# EasyEDA Pro project P1.eprj, board PCB_main_2025-03-03
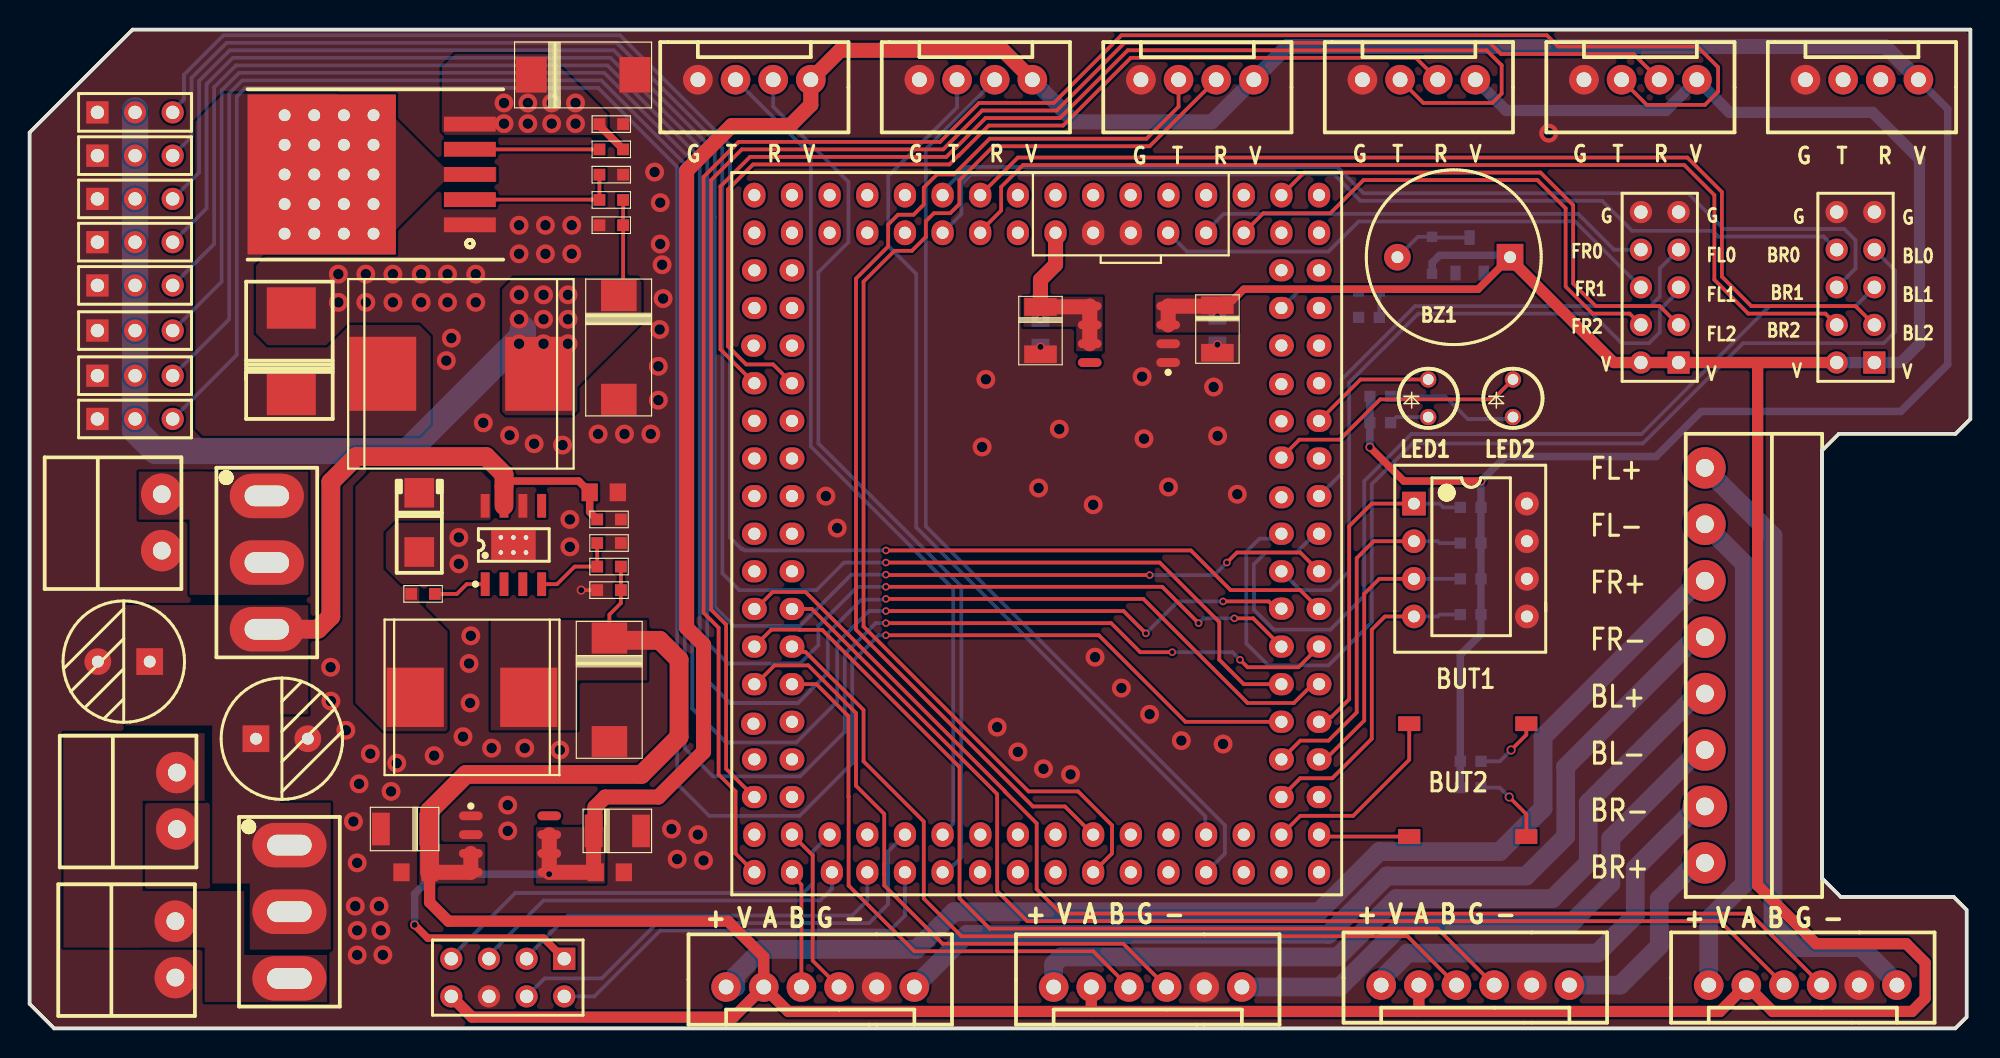
[diagram p4: board, top side]
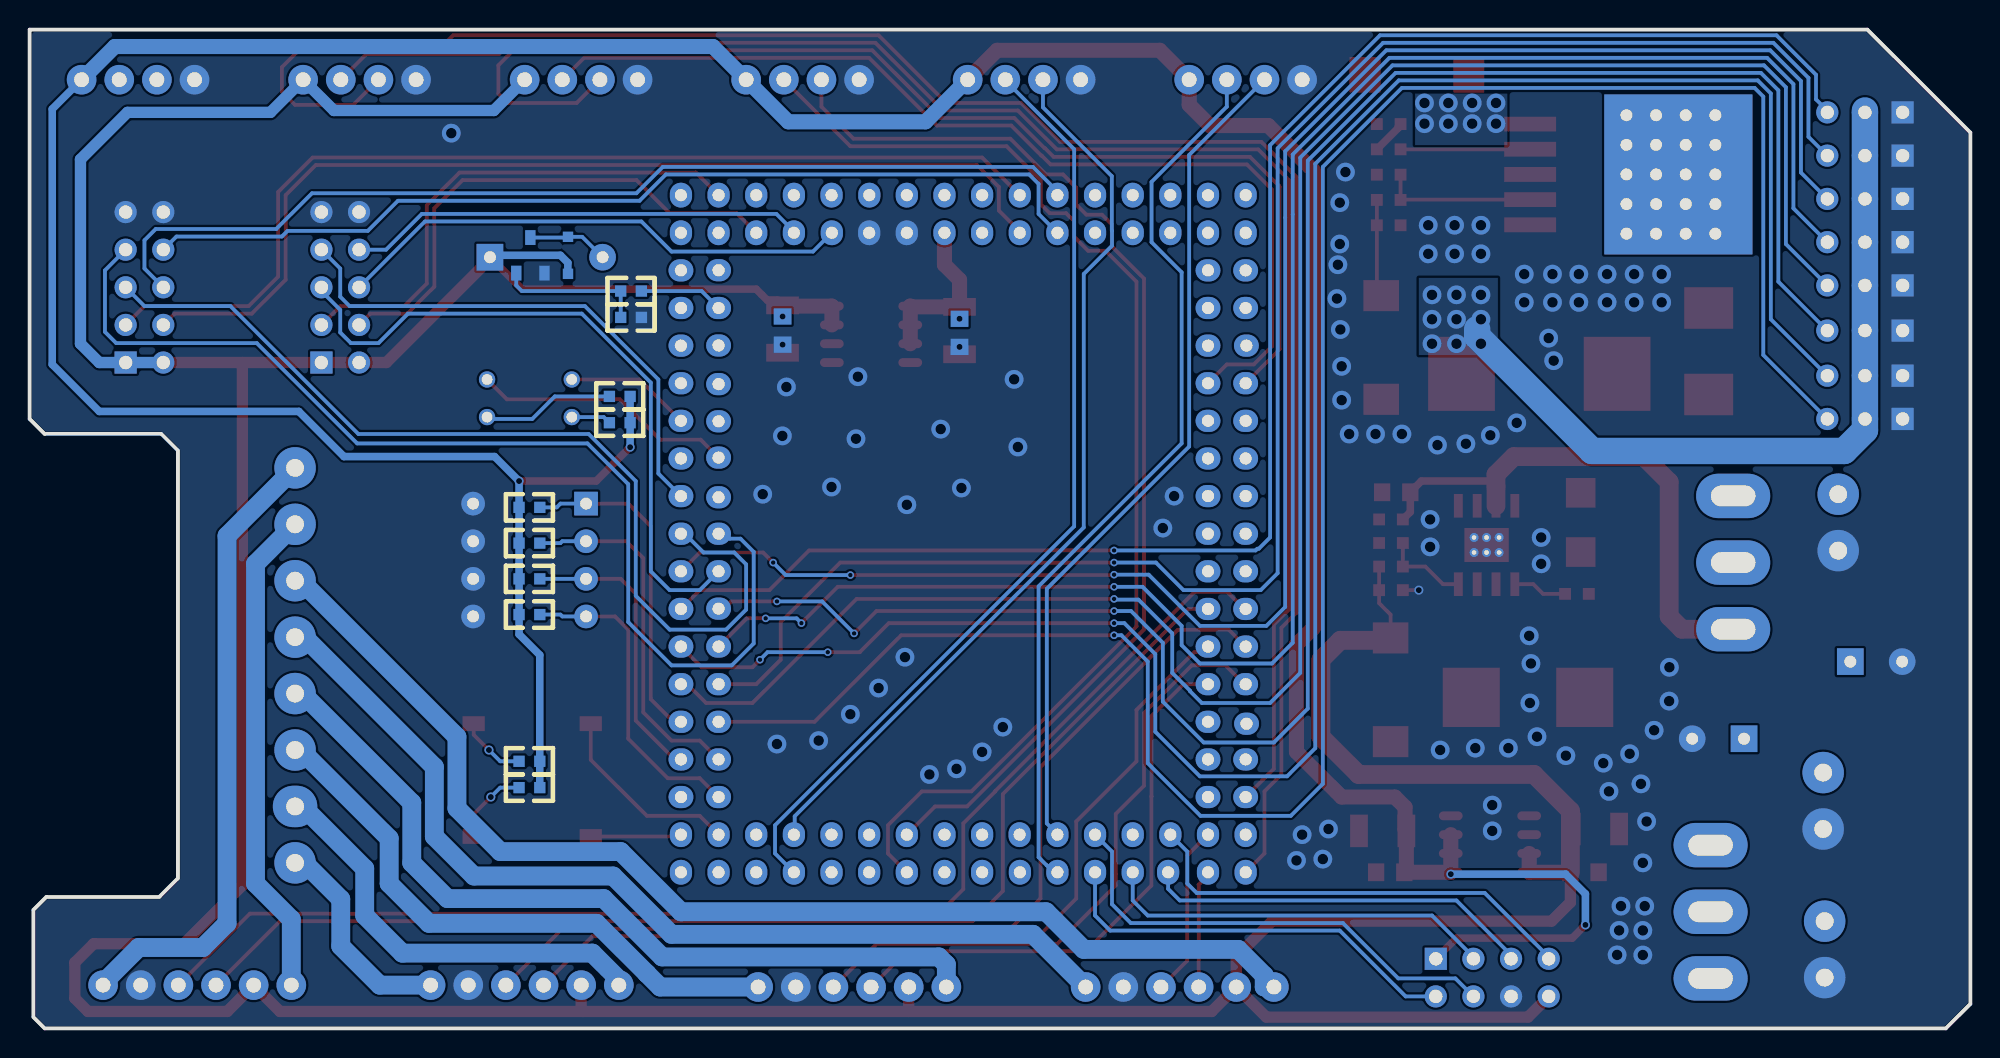
[diagram p5: board, bottom side, seen from below]

Outline 130.94 x 67.44 mm; copper layers: Top Layer, Bottom Layer. Coordinates in mm from the lower left corner of the outline.
Outline path: 0,60.49 6.95,67.44 130.94,67.44 130.94,41.15 129.94,40.15 122.06,40.15 120.94,39.02 120.94,10.13 122.19,8.88 129.81,8.88 130.68,8 130.68,0.76 129.92,0 1.65,0 0,1.65 0,60.49
Stack: Top Layer 0.035mm / Dielectric1 1.51mm FR4 er 4.5 / Bottom Layer 0.035mm

## Design rules (mm)
spacing safeClearance (default): track to track 0.152, other pairs 0.152 to 0.3
track width trackWidth (default): min 0.127, default 0.254, max 2.54
differential pair differentialPair (default): width min 0.127, default 0.254, max 2.54; gap min 0.152, default 0.152
via viaSize (default): diameter min 0.5, default 0.61, max 10; hole min 0.3, default 0.305, max 6
pour ie405 uses CopperRegion
pour ie1011 uses (1)

## Placement (name value [footprint] x y rotation side)
BZ1  Device Name  [BUZZER ACTIVE 12X9]  96.08 52.07 180 top
C14  Device Name  [CAP ELEC 3.5-8.0X12.0(__0.6)]  6.35 24.77 180 top
C15  Device Name  [CAP ELEC 3.5-8.0X12.0(__0.6)]  17.02 19.56 0 top
C38  NO  [CAP TANT 2917/7343-31]  37.34 64.39 180 top
C40  xxuF/xxV/Footprint  [CAP MLCC 0603]  39.24 61.06 0 top
C41  xxuF/xxV/Footprint  [CAP MLCC 0603]  39.24 59.35 0 top
C42  NO  [CAP TANT 2917/7343-31]  39.75 45.97 90 top
C43  xxuF/xxV/Footprint  [CAP MLCC 0603]  39.24 54.23 180 top
C44  xxuF/xxV/Footprint  [CAP MLCC 0805]  38.73 36.2 180 top
C45  xxuF/xxV/Footprint  [CAP MLCC 0603]  39.09 34.36 180 top
C46  xxuF/xxV/Footprint  [CAP MLCC 0603]  26.54 29.34 180 top
C47  NO  [CAP TANT 2917/7343-31]  39.12 22.86 90 top
C48  xxuF/xxV/Footprint  [CAP MLCC 0603]  39.09 29.59 0 top
C56  Device Name  [CAP TANT 1210/3528-21]  80.14 47.22 90 top
C57  Device Name  [CAP MLCC 0805]  80.14 47.12 270 bottom
C58  Device Name  [CAP TANT 1210/3528-21]  68.2 47.12 90 top
C59  Device Name  [CAP MLCC 0805]  68.2 46.96 270 bottom
C76  Device Name  [CAP TANT 1210/3528-21]  25.3 13.46 0 top
C77  Device Name  [CAP MLCC 0805]  26.03 10.54 180 top
C78  Device Name  [CAP TANT 1210/3528-21]  39.65 13.34 180 top
C79  Device Name  [CAP MLCC 0805]  39.14 10.54 0 top
D4  MBRS540/40V/5A  [DO-214AB]  17.65 46.48 270 top
D5  Device Name  [DIODE SMA(DO-214AC)]  26.29 34.16 270 top
D6  Device Name  [DIODE SOD323]  94.61 52.2 90 bottom
J2  HDR-M-2.54_2x5  [HDR2X5]  111.25 44.96 90 top
J3  HDR-M-2.54_2x5  [HDR2X5]  124.46 44.96 90 top
L1  Device Name  [INDC SMDP 744355(13X13)]  29.08 44.2 0 top
L2  Device Name  [INDC SMDP 744325(11X10.5)]  29.84 22.35 0 top
LED1  直插LED  [3MMLED__Ɫ]  100.08 42.55 90 top
LED2  直插LED  [3MMLED__Ɫ]  94.36 42.55 90 top
LQ_KV58P144-SYSVG1  LQ_KV58P144-SYSVG  [KV58_CORE_LQ]  87 15.62 90 top
M1  XH2.54-6  [XH2.54_6]  119.63 2.79 180 top
M2  XH2.54-6  [XH2.54_6]  75.44 2.67 180 top
M3  XH2.54-6  [XH2.54_6]  53.34 2.67 180 top
M4  XH2.54-6  [XH2.54_6]  97.54 2.79 180 top
P1  WJ15EDGRC-3.81-8P  [WJ2EDG-3.81-8P]  113.03 24.51 90 top
P5  WJ15EDGRC-3.81-2P  [WJ2EDG-3.81-2P]  9.02 34.16 270 top
P8  WJ15EDGRC-3.81-2P  [WJ2EDG-3.81-2P]  9.93 5.33 270 top
P9  -  [WJ2EDG-3.81-2P]  10.03 15.37 270 top
P9#2  -  [HDR2X4]  36.07 4.7 180 top
Q3  Device Name  [SOT23-3W]  97.16 52.2 270 bottom
R15  xxR/Precision/Footprint  [RES 0603]  39.24 55.94 0 top
R16  xxR/Precision/Footprint  [RES 0603]  39.24 57.64 180 top
R17  xxR/Precision/Footprint  [RES 0603]  39.09 31.18 0 top
R18  xxR/Precision/Footprint  [RES 0603]  39.09 32.77 180 top
R22  xxR/Precision/Footprint  [0603]  89.66 49.78 0 bottom
R23  xxR/Precision/Footprint  [0603]  89.66 48.01 0 bottom
R31  xxR/Precision/Footprint  [0603]  91.82 42.67 180 bottom
R32  xxR/Precision/Footprint  [0603]  91.82 40.89 180 bottom
R33  xxR/Precision/Footprint  [0603]  97.92 18.03 180 bottom
R34  xxR/Precision/Footprint  [0603]  97.92 16.26 180 bottom
R100  xxR/Precision/Footprint  [0603]  97.92 35.18 180 bottom
R101  xxR/Precision/Footprint  [0603]  97.92 32.77 180 bottom
R102  xxR/Precision/Footprint  [0603]  97.92 30.35 180 bottom
R103  xxR/Precision/Footprint  [0603]  97.92 27.94 180 bottom
S2  Device Name  [SWITCH DIP 2.54-4]  97.28 31.62 0 top
S3  Device Name  [BUTTON SMD 3X6]  97.03 12.95 180 top
S4  Device Name  [SWITCH TOGGLE 7101SYZBE CK]  16 31.45 270 top
S8  Device Name  [SWITCH TOGGLE 7101SYZBE CK]  17.53 7.87 270 top
S9  Device Name  [BUTTON SMD 3X6]  97.03 20.57 180 top
SERVO1  HDR-M-2.54_1x3  [HDR1X3]  4.57 41.15 0 top
SERVO2  HDR-M-2.54_1x3  [HDR1X3]  4.57 50.17 0 top
SERVO3  HDR-M-2.54_1x3  [HDR1X3]  4.57 58.93 0 top
SERVO4  HDR-M-2.54_1x3  [HDR1X3]  4.57 44.07 0 top
SERVO5  HDR-M-2.54_1x3  [HDR1X3]  4.57 53.09 0 top
SERVO6  HDR-M-2.54_1x3  [HDR1X3]  4.57 61.85 0 top
SERVO7  HDR-M-2.54_1x3  [HDR1X3]  4.57 47.12 0 top
SERVO8  HDR-M-2.54_1x3  [HDR1X3]  4.57 56.01 0 top
U16  XL4015  [TO-263-5]  23.45 57.66 90 top
U17  TPS5430  [SOIC8_1.27-PAD]  32.64 32.64 90 top
U18  TPS7333QD  [SOIC8_1.27]  32.41 12.45 270 top
U24  TPS7333QD  [SOIC8_1.27]  74.17 46.86 90 top
UART0  XH2.54-4  [XH2.54_4]  93.73 64.06 0 top
UART1  XH2.54-4  [XH2.54_4]  108.68 64.06 0 top
UART2  XH2.54-4  [XH2.54_4]  78.79 64.06 0 top
UART3  XH2.54-4  [XH2.54_4]  123.62 64.06 0 top
UART4  XH2.54-4  [XH2.54_4]  48.89 64.06 0 top
UART5  XH2.54-4  [XH2.54_4]  63.84 64.06 0 top

## Footprints (pads in the part's own frame, mm; a bottom-side part is the same pattern mirrored in y, then rotated)
3MMLED__Ɫ
  round 1.1 hole 0.72: 1(-1.27,0) 2(1.27,0)
0603
  rect 0.762x0.762 smd: 1(0,0) 2(1.397,0)
BUTTON SMD 3X6
  rect 1.5x1 smd: 1(-3.95,0) 2(3.95,0)
BUZZER ACTIVE 12X9
  rect 1.8x1.8 hole 0.8: 1(-3.8,0)
  round 1.8 hole 0.8: 2(3.8,0)
CAP ELEC 3.5-8.0X12.0(__0.6)
  rect 1.8x1.8 hole 0.8: 1(-1.75,0)
  round 1.8 hole 0.8: 2(1.75,0)
CAP MLCC 0603
  rect 0.8x0.8 smd: 1(-0.8,0) 2(0.8,0)
CAP MLCC 0805
  rect 1.1x1.2 smd: 1(-0.95,0) 2(0.95,0)
CAP TANT 1210/3528-21
  rect 1.2x2.2 smd: 1(1.6,0) 2(-1.6,0)
CAP TANT 2917/7343-31
  rect 2.1x2.4 smd: 1(3.5,0) 2(-3.5,0)
DIODE SMA(DO-214AC)
  rect 2x2 smd: 1(2,0) 2(-2,0)
DIODE SOD323
  rect 0.7x0.7 smd: 1(1.25,0) 2(-1.25,0)
DO-214AB
  rect 2.8x3.3 smd: 1(-2.159,0) 2(3.683,0)
HDR1X3
  rect 1.5x1.5 hole 0.9: 1(0,0)
  round 1.5 hole 0.9: 2(2.54,0) 3(5.08,0)
HDR2X4
  rect 1.5x1.5 hole 0.9: 1(0,0)
  round 1.5 hole 0.9: 2(0,2.54) 3(2.54,0) 4(2.54,2.54) 5(5.08,0) 6(5.08,2.54) 7(7.62,0) 8(7.62,2.54)
HDR2X5
  rect 1.5x1.5 hole 0.9: 1(0,0)
  round 1.5 hole 0.9: 2(0,2.54) 3(2.54,0) 4(2.54,2.54) 5(5.08,0) 6(5.08,2.54) 7(7.62,0) 8(7.62,2.54) 9(10.16,0) 10(10.16,2.54)
INDC SMDP 744325(11X10.5)
  rect 3.85x4 smd: 1(-3.83,0) 2(3.83,0)
INDC SMDP 744355(13X13)
  rect 4.5x5 smd: 1(-5.25,0) 2(5.25,0)
KV58_CORE_LQ
  oval 1.498x1.677 hole 0.813x0.818: 1(0,0) 2(0,2.54) 3(2.54,0) 4(2.54,2.54) 5(5.08,0) 6(5.08,2.54) 7(7.62,0) 8(7.62,2.54) 9(10.16,0) 10(10.16,2.54) 11(12.7,0) 12(12.72,2.54) 13(15.24,0) 14(15.24,2.54) 15(17.78,0) 16(17.78,2.54) 17(20.32,0) 18(20.24,2.54) 19(22.86,0) 20(22.92,2.54) 21(25.4,0) 22(25.37,2.54) 23(27.94,0) 24(27.88,2.54) 25(30.48,0) 26(30.49,2.54) 27(33.02,0) 28(33.02,2.54) 29(35.56,0) 30(35.57,2.54) 63(35.56,38.1) 64(35.56,35.56) 65(33.02,38.1) 66(33.02,35.56) 67(30.48,38.15) 68(30.48,35.56) 69(27.94,38.1) 70(27.94,35.56) 71(25.4,38.1) 72(25.4,35.56) 73(22.86,38.1) 74(22.86,35.56) 75(20.32,38.1) 76(20.32,35.56) 77(17.78,38.1) 78(17.78,35.56) 79(15.24,38.1) 80(15.24,35.56) 81(12.7,38.1) 82(12.7,35.56) 83(10.16,38.1) 84(10.16,35.56) 85(7.62,38.1) 86(7.62,35.56) 87(4.95,38.16) 88(5.08,35.56) 89(2.54,38.1) 90(2.54,35.56) 91(0,38.1) 92(0,35.56)
  oval 1.677x1.498 hole 0.818x0.813: 31(38.1,0) 32(40.64,0) 33(38.1,2.54) 34(40.64,2.54) 35(38.1,5.08) 36(40.64,5.08) 37(38.1,7.62) 38(40.64,7.62) 39(38.1,10.18) 40(40.64,10.16) 41(38.1,12.7) 42(40.64,12.71) 43(38.1,15.24) 44(40.64,15.24) 45(38.1,17.78) 46(40.64,17.78) 47(38.1,20.32) 48(40.64,20.32) 49(38.1,22.86) 50(40.64,22.86) 51(38.1,25.4) 52(40.64,25.4) 53(38.1,27.94) 54(40.64,27.94) 55(38.1,30.48) 56(40.64,30.48) 57(38.1,33.02) 58(40.64,33.02) 59(38.1,35.56) 60(40.64,35.56) 61(38.1,38.1) 62(40.64,38.1) 93(-2.54,38.1) 94(-5.08,38.1) 95(-2.54,35.56) 96(-5.08,35.56) 97(-2.54,33.02) 98(-5.08,32.87) 99(-2.54,30.48) 100(-5.08,30.48) 101(-2.54,27.94) 102(-5.08,27.94) 103(-2.54,25.4) 104(-5.08,25.4) 105(-2.54,22.85) 106(-5.08,22.87) 107(-2.54,20.32) 108(-5.08,20.32) 109(-2.54,17.78) 110(-5.08,17.78) 111(-2.54,15.24) 112(-5.08,15.24) 113(-2.54,12.7) 114(-5.08,12.7) 115(-2.54,10.16) 116(-5.08,10.16) 117(-2.54,7.62) 118(-5.08,7.62) 119(-2.54,5.08) 120(-5.08,5.08) 121(-2.54,2.54) 122(-5.08,2.54) 123(-2.54,0) 124(-5.08,0)
RES 0603
  rect 0.8x0.8 smd: 1(-0.8,0) 2(0.8,0)
SOIC8_1.27
  oval 0.6x1.6 smd: 1(-1.905,-2.645) 2(-0.635,-2.645) 3(0.635,-2.645) 4(1.905,-2.645) 5(1.905,2.645) 6(0.635,2.645) 7(-0.635,2.645) 8(-1.905,2.645)
SOIC8_1.27-PAD
  rect 1.6x0.6 smd: 1(-2.645,1.905) 2(-2.645,0.635) 3(-2.645,-0.635) 4(-2.645,-1.905) 5(2.645,-1.905) 6(2.645,-0.635) 7(2.645,0.635) 8(2.645,1.905)
  round 0.61 hole 0.31x0.305: 9(-0.508,0.847) 9(-0.508,0) 9(-0.508,-0.847) 9(0.508,0.847) 9(0.508,0) 9(0.508,-0.847)
  rect 2.3x3 smd: 9(0,0)
SOT23-3W
  rect 1x0.7 smd: 1(1.2,-0.95) 2(1.2,0.95) 3(-1.2,0)
SWITCH DIP 2.54-4
  rect 1.6x1.6 hole 0.8: 1(-3.886,3.81)
  round 1.6 hole 0.8: 2(-3.886,1.27) 3(-3.886,-1.27) 4(-3.886,-3.81) 5(3.734,-3.81) 6(3.734,-1.27) 7(3.734,1.27) 8(3.734,3.81)
SWITCH TOGGLE 7101SYZBE CK
  oval 3x5 hole 1.4x3: 1(-4.5,0) 2(0,0) 3(4.5,0)
TO-263-5
  rect 1x3.5 smd: 1(-3.4,-6.25) 2(-1.7,-6.25) 3(0,-6.25) 4(1.7,-6.25) 5(3.4,-6.25)
  round 1.5 hole 0.8: 6(-4,6.25) 6(-4,4.25) 6(-4,2.25) 6(-4,0.25) 6(-2,6.25) 6(-2,4.25) 6(-2,2.25) 6(-2,0.25) 6(0,6.25) 6(0,4.25) 6(0,2.25) 6(0,0.25) 6(2,6.25) 6(2,4.25) 6(2,2.25) 6(2,0.25) 6(4,6.25) 6(4,4.25) 6(4,2.25) 6(4,0.25)
  rect 10.8x10 smd: 6(0,3.75)
  rect 10.8x10 smd far side: 6(0,3.75)
WJ2EDG-3.81-2P
  round 2.8 hole 1.2: 1(1.905,-0.102) 2(-1.905,-0.102)
WJ2EDG-3.81-8P
  round 2.8 hole 1.2: 1(13.335,0) 2(9.525,0) 3(5.715,0) 4(1.905,0) 5(-1.905,0) 6(-5.715,0) 8(-13.335,0)
  oval 2.8x3 hole 1.2: 7(-9.525,0)
XH2.54_4
  round 2 hole 1: 1(-3.81,0) 2(-1.27,0) 3(1.27,0) 4(3.81,0)
XH2.54_6
  round 2 hole 1: 1(-6.35,-0.127) 2(-3.81,-0.127) 3(-1.27,-0.127) 4(1.27,-0.127) 5(3.81,-0.127) 6(6.35,-0.127)

## Nets
3V3: C58.1 C59.1 LQ_KV58P144-SYSVG1.45 U24.5 U24.6 U24.7
3V3_OTH: C78.1 C79.1 P9#2.1 R31.2 R32.2 R33.2 R34.2 R100.1 R101.1 R102.1 R103.1 U18.5 U18.6 U18.7 UART2.4 UART3.4 UART4.4 UART5.4
5V: BZ1.1 C47.1 C48.2 C56.1 C57.1 C76.1 C77.1 D6.2 J2.1 J2.2 J3.1 J3.2 L2.2 M1.5 M2.5 M3.5 M4.5 P9#2.8 R17.2 U18.3 U18.4 U24.3 U24.4 UART0.4 UART1.4
GND: C14.2 C15.2 C38.2 C40.2 C42.2 C43.2 C44.1 C45.1 C47.2 C48.1 C56.2 C57.2 C58.2 C59.2 C76.2 C77.2 C78.2 C79.2 D4.1 D5.1 J2.9 J2.10 J3.9 J3.10 LQ_KV58P144-SYSVG1.41 LQ_KV58P144-SYSVG1.43 M1.2 M2.2 M3.2 M4.2 P5.1 P8.1 P9.1 P9#2.6 Q3.2 R16.1 R18.1 R23.1 S2.5 S2.6 S2.7 S2.8 SERVO1.1 SERVO2.1 SERVO3.1 SERVO4.1 SERVO5.1 SERVO6.1 SERVO7.1 SERVO8.1 U16.1 U17.6 U17.9 U18.1 U18.2 U24.1 U24.2 UART0.1 UART1.1 UART2.1 UART3.1 UART4.1 UART5.1
VCC: P8.2 P9.2 S8.3
VIN: C14.1 C15.1 C38.1 C40.1 C41.2 C44.2 C45.2 S4.3 S8.1 S8.2 U16.5 U17.7
ADC0_SE0: LQ_KV58P144-SYSVG1.26
ADC0_SE8: LQ_KV58P144-SYSVG1.27
BEEP_PWM: LQ_KV58P144-SYSVG1.28 R22.1
BUT1: LQ_KV58P144-SYSVG1.121 S9.2
BUT2: LQ_KV58P144-SYSVG1.123 S3.2
DAC0: LQ_KV58P144-SYSVG1.29
DAC1: LQ_KV58P144-SYSVG1.30
GPIO1: LQ_KV58P144-SYSVG1.100 P9#2.3
GPIO2: LQ_KV58P144-SYSVG1.98 P9#2.5
GPIO3: LQ_KV58P144-SYSVG1.97 P9#2.7
GPIO4: LQ_KV58P144-SYSVG1.102 P9#2.2
GPIO5: LQ_KV58P144-SYSVG1.101 P9#2.4
HSADC0CH2: LQ_KV58P144-SYSVG1.22
HSADC0CH3: LQ_KV58P144-SYSVG1.23
HSADC0CH6: LQ_KV58P144-SYSVG1.18
HSADC0CH7: LQ_KV58P144-SYSVG1.19
HSADC0CH10: LQ_KV58P144-SYSVG1.24
HSADC0CH11: LQ_KV58P144-SYSVG1.25
HSADC0CH12: LQ_KV58P144-SYSVG1.31
LED1: LED1.2 LQ_KV58P144-SYSVG1.20
LED2: LED2.2 LQ_KV58P144-SYSVG1.21
MOTOR_BL_+: M2.6 P1.5
MOTOR_BL_-: M2.1 P1.6
MOTOR_BL_A: LQ_KV58P144-SYSVG1.86 M2.4
MOTOR_BL_B: LQ_KV58P144-SYSVG1.85 M2.3
MOTOR_BR_+: M4.1 P1.8
MOTOR_BR_-: M4.6 P1.7
MOTOR_BR_A: LQ_KV58P144-SYSVG1.84 M4.4
MOTOR_BR_B: LQ_KV58P144-SYSVG1.83 M4.3
MOTOR_DIR_BL1: J3.5 LQ_KV58P144-SYSVG1.15
MOTOR_DIR_BL2: J3.7 LQ_KV58P144-SYSVG1.16
MOTOR_DIR_BR1: J3.6 LQ_KV58P144-SYSVG1.52
MOTOR_DIR_BR2: J3.8 LQ_KV58P144-SYSVG1.51
MOTOR_DIR_FL1: J2.5 LQ_KV58P144-SYSVG1.14
MOTOR_DIR_FL2: J2.7 LQ_KV58P144-SYSVG1.17
MOTOR_DIR_FR1: J2.6 LQ_KV58P144-SYSVG1.39
MOTOR_DIR_FR2: J2.8 LQ_KV58P144-SYSVG1.37
MOTOR_FL_+: M1.1 P1.1
MOTOR_FL_-: M1.6 P1.2
MOTOR_FL_A: LQ_KV58P144-SYSVG1.82 M1.4
MOTOR_FL_B: LQ_KV58P144-SYSVG1.81 M1.3
MOTOR_FR_+: M3.6 P1.3
MOTOR_FR_-: M3.1 P1.4
MOTOR_FR_A: LQ_KV58P144-SYSVG1.96 M3.4
MOTOR_FR_B: LQ_KV58P144-SYSVG1.95 M3.3
MOTOR_FTM_BL: J3.3 LQ_KV58P144-SYSVG1.50
MOTOR_FTM_BR: J3.4 LQ_KV58P144-SYSVG1.49
MOTOR_FTM_FL: J2.3 LQ_KV58P144-SYSVG1.34
MOTOR_FTM_FR: J2.4 LQ_KV58P144-SYSVG1.35
NETBZ1_2: BZ1.2 D6.1 Q3.3
NETC41_1: C41.1 U16.4
NETC46_1: C46.1 U17.1
NETC46_2: C46.2 D5.2 L2.1 U17.8
NETD4_2: D4.2 L1.1 U16.3 U16.6
NETLED1_1: LED1.1 R31.1
NETLED2_1: LED2.1 R32.1
NETP5_2: P5.2 S4.1 S4.2
NETQ3_1: Q3.1 R22.2 R23.2
NETR15_1: R15.1 R16.2 U16.2
NETR17_1: R17.1 R18.2 U17.4
NETR33_1: R33.1 S9.1
NETR34_1: R34.1 S3.1
PA0: LQ_KV58P144-SYSVG1.44
PA1: LQ_KV58P144-SYSVG1.40
PA2: LQ_KV58P144-SYSVG1.42
PA3: LQ_KV58P144-SYSVG1.46
PA4: LQ_KV58P144-SYSVG1.47
PA5: LQ_KV58P144-SYSVG1.48
PA10: LQ_KV58P144-SYSVG1.53
PA11: LQ_KV58P144-SYSVG1.54
PA12: LQ_KV58P144-SYSVG1.55
PA13: LQ_KV58P144-SYSVG1.56
PA14: LQ_KV58P144-SYSVG1.57
PA15: LQ_KV58P144-SYSVG1.58
PA16: LQ_KV58P144-SYSVG1.59
PA17: LQ_KV58P144-SYSVG1.60
PA18: LQ_KV58P144-SYSVG1.61
PA19: LQ_KV58P144-SYSVG1.62
PA24: LQ_KV58P144-SYSVG1.64
PA25: LQ_KV58P144-SYSVG1.63
PA26: LQ_KV58P144-SYSVG1.66
PA27: LQ_KV58P144-SYSVG1.65
PA28: LQ_KV58P144-SYSVG1.68
PA29: LQ_KV58P144-SYSVG1.67
PB0: LQ_KV58P144-SYSVG1.70 UART0.3
PB1: LQ_KV58P144-SYSVG1.69 UART0.2
PB2: LQ_KV58P144-SYSVG1.72
PB3: LQ_KV58P144-SYSVG1.71
PB4: LQ_KV58P144-SYSVG1.74
PB5: LQ_KV58P144-SYSVG1.73
PB6: LQ_KV58P144-SYSVG1.76
PB7: LQ_KV58P144-SYSVG1.75
PB8: LQ_KV58P144-SYSVG1.78
PB9: LQ_KV58P144-SYSVG1.77
PB10: LQ_KV58P144-SYSVG1.80
PB11: LQ_KV58P144-SYSVG1.79
PB22: LQ_KV58P144-SYSVG1.88
PB23: LQ_KV58P144-SYSVG1.87
PC0: LQ_KV58P144-SYSVG1.90
PC1: LQ_KV58P144-SYSVG1.89
PC2: LQ_KV58P144-SYSVG1.92
PC3: LQ_KV58P144-SYSVG1.91 UART1.3
PC4: LQ_KV58P144-SYSVG1.94 UART1.2
PC5: LQ_KV58P144-SYSVG1.93
PC11: LQ_KV58P144-SYSVG1.99
PC14: LQ_KV58P144-SYSVG1.104 UART4.3
PC15: LQ_KV58P144-SYSVG1.103 UART4.2
PC16: LQ_KV58P144-SYSVG1.106
PC17: LQ_KV58P144-SYSVG1.105
PC18: LQ_KV58P144-SYSVG1.108
PC19: LQ_KV58P144-SYSVG1.107
PD0: LQ_KV58P144-SYSVG1.110
PD1: LQ_KV58P144-SYSVG1.109
PD2: LQ_KV58P144-SYSVG1.112 UART2.3
PD3: LQ_KV58P144-SYSVG1.111 UART2.2
PD4: LQ_KV58P144-SYSVG1.114
PD5: LQ_KV58P144-SYSVG1.113
PD6: LQ_KV58P144-SYSVG1.116
PD7: LQ_KV58P144-SYSVG1.115
PD8: LQ_KV58P144-SYSVG1.118 UART5.3
PD9: LQ_KV58P144-SYSVG1.117 UART5.2
PD10: LQ_KV58P144-SYSVG1.120
PD11: LQ_KV58P144-SYSVG1.119
PD12: LQ_KV58P144-SYSVG1.122
PD14: LQ_KV58P144-SYSVG1.124
PE0: LQ_KV58P144-SYSVG1.1
PE1: LQ_KV58P144-SYSVG1.2 R103.2 S2.4
PE2: LQ_KV58P144-SYSVG1.3 R102.2 S2.3
PE3: LQ_KV58P144-SYSVG1.4 R101.2 S2.2
PE4: LQ_KV58P144-SYSVG1.5 R100.2 S2.1
PE5: LQ_KV58P144-SYSVG1.6 SERVO1.3
PE6: LQ_KV58P144-SYSVG1.7 SERVO2.3
PE7: LQ_KV58P144-SYSVG1.8 SERVO3.3
PE8: LQ_KV58P144-SYSVG1.9 SERVO4.3
PE9: LQ_KV58P144-SYSVG1.10 SERVO5.3
PE10: LQ_KV58P144-SYSVG1.11 SERVO6.3
PE11: LQ_KV58P144-SYSVG1.12 SERVO7.3
PE12: LQ_KV58P144-SYSVG1.13 SERVO8.3
PE22: LQ_KV58P144-SYSVG1.32
PE23: LQ_KV58P144-SYSVG1.33
PE26: LQ_KV58P144-SYSVG1.36
RESET: LQ_KV58P144-SYSVG1.38
RX_UART3: UART3.3
SERVO_POWER: C42.1 C43.1 L1.2 R15.2 SERVO1.2 SERVO2.2 SERVO3.2 SERVO4.2 SERVO5.2 SERVO6.2 SERVO7.2 SERVO8.2
TX_UART3: UART3.2

Pads without a net: U17 2 3 5; U18 8; U24 8

## Via types
v1: diameter 1.27, hole 0.711, Top Layer to Bottom Layer, 108 vias
v2: diameter 0.61, hole 0.406, Top Layer to Bottom Layer, 11 vias
v3: diameter 0.508, hole 0.305, Top Layer to Bottom Layer, 16 vias

## Routing (per net, layer and track width the routed paths; a pad name or vN(x,y) marks a point on that pad's centre or on a via; arc(x,y) is an arc through that point)
3V3: length 11.3
  Top Layer w1.016: LQ_KV58P144-SYSVG1.45 69.22,51.56 68.2,50.55 C58.1 71.47,48.72 U24.5 U24.6 71.52,46.23
  vias: v2(68.2,47.91)
3V3_OTH: length 261.9
  Top Layer w0.508: v2(90.42,39.24) 92.71,36.96 v2(97.92,36.96) ; P9#2.1 34.67,6.1 26.86,6.1 v2(25.97,6.99)
  Top Layer w1.016: 38.05,10.54 U18.5 U18.6 U18.7 ; 38.05,10.54 C78.1 38.14,13.43 38.14,14.94 38.83,15.62 42.42,15.62 45.47,18.67 45.47,25.91 44.32,27.05 44.32,57.91 47.37,60.96 51.31,60.96 52.7,62.36 UART4.4 54.69,66.04 65.66,66.04 UART5.4 ; 38.05,10.54 C79.1
  Bottom Layer w0.508: R34.2 R33.2 96.52,25.21 97.92,26.61 R103.1 R102.1 R101.1 R100.1 v2(97.92,36.96) 99.57,38.61 109.73,38.61 112.78,41.66 126.24,41.66 129.41,44.83 129.41,62.07 UART3.4 ; R31.2 R32.2 v2(90.42,39.24) ; v2(25.97,6.99) 25.97,9.08 27.3,10.41 v2(35.05,10.41)
  Bottom Layer w1.016: UART3.4 125.19,66.29 84.84,66.29 UART2.4 79.75,61.21 70.49,61.21 UART5.4
5V: length 338.4
  Top Layer w0.254: R17.2 C48.2 39.89,28.71 39.12,27.94 C47.1
  Top Layer w0.508: 99.88,52.07 97.72,49.91 81.91,49.91 81.17,49.16 80.48,49.16 C56.1
  Top Layer w0.762: M3.5 51.18,1.14 71.63,1.14 ; M3.5 49.53,4.83 47.12,7.24 28.25,7.24 26.98,8.51 C77.1 ; M3.5 47.5,0.76 29.84,0.76 P9#2.8 ; 93.6,1.14 93.73,1.27 M4.5 ; 93.6,1.14 114.05,1.14 M1.5 117.6,1.14 127,1.14 127.89,2.03 127.89,4.44 126.62,5.72 120.52,5.72 116.59,9.65 116.59,44.96 ; 93.6,1.14 71.63,1.14 ; 71.63,1.14 M2.5 ; 116.59,44.96 J2.1 J2.2 106.87,44.96 99.82,52.01 ; 116.59,44.96 J3.2
  Top Layer w1.016: C56.1 80.09,48.77 76.81,48.77 76.81,47.5 ; C77.1 U18.4 U18.3
  Top Layer w1.27: C47.1 39.27,26.2 42.5,26.2 43.81,24.89 43.81,19.69 41.27,17.14 29.44,17.14 26.98,14.69 C77.1
  Bottom Layer w0.508: D6.2 94.62,50.96 94.62,51.7 95.12,52.2 99.76,52.2 99.88,52.07
  Bottom Layer w0.762: UART0.4 99.62,61.98 110.41,61.98 UART1.4 114.69,61.85 124.33,61.85 127.51,58.67 127.51,46.23 126.24,44.96 J3.1 J3.2
  vias: v2(80.14,48.07)
GND: length 1.1
  Top Layer w0.254: v2(37.21,29.59) C48.1
  vias: v1(20.31,24.38) v1(20.32,22.1) v1(20.83,50.93) v1(20.83,49.02) v1(21.34,20.13) v1(21.84,13.97) v1(21.97,8.25) v1(22.1,11.18) v1(22.1,6.61) v1(22.1,4.95) v1(22.22,16.51) v1(22.68,50.93) v1(22.68,49.02) v1(22.99,18.54) v1(23.57,8.25) v1(23.7,6.61) v1(23.83,4.96) v1(24.38,16) v1(24.51,50.93) v1(24.51,49.02) v1(24.77,17.91) v1(26.42,50.93) v1(26.42,49.02) v1(27.29,18.42) v1(28.11,45.09) v1(28.19,50.93) v1(28.19,49.02) v1(28.45,46.61) v1(28.96,33.15) v1(28.96,31.37) v1(29.24,19.69) v1(29.65,24.64) v1(29.72,21.97) v1(29.77,26.51) v1(30.1,50.93) v1(30.1,49.02) v1(30.61,40.89) v1(31.17,18.92) v1(32.26,15.08) v1(32.26,13.34) v1(32.38,40.04) v1(33.02,54.23) v1(33.02,52.3) v1(33.4,18.92) v1(34.04,39.47) v1(34.8,54.23) v1(34.8,52.3) v1(35.77,18.8) v1(35.95,39.38) v1(36.45,34.36) v1(36.45,32.51) v1(36.58,54.23) v1(36.58,52.3) v1(38.35,40.13) v1(40.13,40.13) v1(41.91,40.13) v1(42.16,57.82) v1(42.42,44.7) v1(42.42,42.42) v1(42.54,55.75) v1(42.54,52.96) v1(42.5,47.19) v1(42.67,51.56) v1(42.74,49.28) v1(43.31,13.46) v1(43.69,11.43) v1(45.09,13.08) v1(45.47,11.34) v1(53.72,35.94) v1(54.48,33.78) v1(64.26,39.26) v1(64.52,43.82) v1(65.28,20.34) v1(66.67,18.67) v1(68.07,36.49) v1(68.4,17.53) v1(69.47,40.46) v1(70.23,17.14) v1(71.75,35.36) v1(71.88,25.07) v1(73.66,22.98) v1(75.06,44) v1(75.18,39.81) v1(75.56,21.21) v1(76.84,36.55) v1(77.7,19.43) v1(79.88,43.31) v1(80.15,40) v1(80.52,19.2) v1(81.48,36.07) v1(102.49,60.45) v2(68.2,46.01) v2(80.14,46.17)
VIN: length 39.5
  Top Layer w0.508: C40.1 38.59,60.91 38.59,60.81 C41.2 ; C45.2 37.78,34.87 C44.2 37.78,36.25 37.49,36.54 37.45,36.54 37.04,36.96 32.38,36.96 32,36.58
  Top Layer w1.27: 32,35.28 32,37.4 30.8,38.61 22.03,38.61 20.32,36.89 20.32,27.81 19.46,26.95 S4.3
  vias: v1(32,62.48) v1(32,61.09) v1(33.61,62.48) v1(33.61,61.09) v1(35.22,62.48) v1(35.22,61.09) v1(36.83,62.48) v1(36.83,61.09)
BEEP_PWM: length 5.7
  Bottom Layer w0.254: R22.1 85.6,49.78 LQ_KV58P144-SYSVG1.28
BUT1: length 13.2
  Top Layer w0.254: S9.2 93.08,18.14 89.29,14.35 85.72,14.35 LQ_KV58P144-SYSVG1.121
BUT2: length 6.1
  Top Layer w0.254: LQ_KV58P144-SYSVG1.123 87.12,12.95 S3.2
GPIO1: length 26.6
  Bottom Layer w0.254: P9#2.3 33.53,4.83 36.32,7.62 55.5,7.62 56.51,8.64 LQ_KV58P144-SYSVG1.100
GPIO2: length 26.4
  Bottom Layer w0.254: LQ_KV58P144-SYSVG1.98 54.12,9.42 53.34,8.64 34.67,8.64 30.99,4.95 P9#2.5
GPIO3: length 30.3
  Bottom Layer w0.254: LQ_KV58P144-SYSVG1.97 52.83,11.94 52.83,9.78 52.2,9.14 32.77,9.14 28.45,4.83 P9#2.7
GPIO4: length 28.2
  Bottom Layer w0.254: P9#2.2 38.1,2.16 42.54,6.6 58.04,6.6 59.06,7.62 LQ_KV58P144-SYSVG1.102
GPIO5: length 32.1
  Bottom Layer w0.254: P9#2.4 34.74,3.37 38.6,3.37 42.33,7.11 56.64,7.11 57.91,8.38 57.91,11.94 LQ_KV58P144-SYSVG1.101
LED1: length 17.8
  Top Layer w0.254: LQ_KV58P144-SYSVG1.20 85.66,39.75 88.39,39.75 91.11,42.47 98.73,42.47 LED1.2
LED2: length 8.5
  Top Layer w0.254: LED2.2 89.79,43.81 LQ_KV58P144-SYSVG1.21
MOTOR_BL_+: length 55.4
  Bottom Layer w1.27: P1.5 112.52,22.61 105.16,15.24 105.16,11.18 102.74,8.76 92.2,8.76 88.26,4.83 69.6,4.83 69.09,4.32 M2.6
MOTOR_BL_-: length 39.7
  Bottom Layer w1.27: M2.1 88.39,2.79 89.3,3.7 89.3,3.7 92.69,7.09 104,7.09 106.68,9.78 106.68,12.83 112.65,18.8 113.03,18.8
MOTOR_BL_A: length 37.9
  Top Layer w0.254: M2.4 71.75,5.21 59.69,5.21 55.26,9.64 55.26,15.65 55.25,15.66 55.25,21.08 53.09,23.24 LQ_KV58P144-SYSVG1.86
MOTOR_BL_B: length 43
  Top Layer w0.254: M2.3 73.79,5.72 61.59,5.72 57.66,9.65 57.66,10.41 57.65,10.43 57.65,11.1 57.66,11.11 57.66,14.48 55.75,16.38 55.75,21.29 52.53,24.51 50.25,24.51 48.98,23.24 LQ_KV58P144-SYSVG1.85
MOTOR_BR_+: length 14.4
  Bottom Layer w1.27: M4.1 107.31,2.92 109.95,5.55 109.95,8.73 112.39,11.18 113.03,11.18
MOTOR_BR_-: length 28.9
  Bottom Layer w1.27: M4.6 91.23,2.96 91.23,3.34 92.97,5.08 105.79,5.08 108.33,7.62 108.33,10.8 112.52,14.99 P1.7
MOTOR_BR_A: length 59.4
  Top Layer w0.254: M4.4 92.96,6.22 62.86,6.22 60.32,8.76 60.32,13.97 56.26,18.03 56.26,21.5 52.34,25.42 52.22,25.42 51.86,25.78 LQ_KV58P144-SYSVG1.84
MOTOR_BR_B: length 65.5
  Top Layer w0.254: LQ_KV58P144-SYSVG1.83 50.04,26.92 51.94,26.92 51.96,26.91 53.47,26.91 62.74,17.64 62.74,8.77 64.78,6.73 95,6.73 M4.3
MOTOR_DIR_BL1: length 64.8
  Bottom Layer w0.254: LQ_KV58P144-SYSVG1.15 86.74,33.4 85.47,32.13 83.4,32.13 82.6,31.33 82.6,28.28 83.95,26.92 87.76,26.92 90.04,29.21 90.04,36.96 93.22,40.13 108.76,40.13 117.39,48.77 123.19,48.77 J3.5
MOTOR_DIR_BL2: length 74.4
  Bottom Layer w0.254: J3.7 125.86,51.18 125.86,47.03 125.09,46.27 115.61,46.27 108.84,39.5 93.3,39.5 90.55,36.75 90.55,27.43 87.63,24.51 83.57,24.51 82.09,25.99 82.09,32.18 82.98,33.07 83.69,33.07 84.03,33.4 LQ_KV58P144-SYSVG1.16
MOTOR_DIR_BR1: length 68.3
  Bottom Layer w0.254: J3.6 123.19,51.31 123.19,53.21 122.43,53.98 114.3,53.98 111.89,56.39 90,56.39 88.22,58.17 63.25,58.17 61.59,56.52 LQ_KV58P144-SYSVG1.52
MOTOR_DIR_BR2: length 65.3
  Bottom Layer w0.254: J3.8 121.03,53.47 113.92,53.47 113.54,53.85 108.12,53.85 106.09,55.88 89.79,55.88 88.01,57.66 63.5,57.66 62.86,57.02 62.86,54.99 LQ_KV58P144-SYSVG1.51
MOTOR_DIR_FL1: length 45.9
  Bottom Layer w0.254: J2.5 111.25,49.78 109.98,48.51 109.98,46.99 109.26,46.27 107.4,46.27 105.41,48.26 93.68,48.26 89.03,43.6 89.03,30.86 87.76,29.59 85.72,29.59 LQ_KV58P144-SYSVG1.14
MOTOR_DIR_FL2: length 36
  Bottom Layer w0.254: J2.7 109.98,51.31 109.98,49.4 109.35,48.77 93.47,48.77 88.52,43.81 88.52,37.47 LQ_KV58P144-SYSVG1.17
MOTOR_DIR_FR1: length 35.1
  Bottom Layer w0.254: J2.6 104.27,54.48 89.66,54.48 87.63,52.45 78.09,52.45 LQ_KV58P144-SYSVG1.39
MOTOR_DIR_FR2: length 30.9
  Bottom Layer w0.254: LQ_KV58P144-SYSVG1.37 79.38,53.81 80.56,54.99 104.48,54.99 106.89,52.58 J2.8
MOTOR_FL_+: length 42.8
  Bottom Layer w1.27: P1.1 117.62,33.26 117.62,7.09 119.25,5.46 123.58,5.46 125.98,3.05 M1.1
MOTOR_FL_-: length 33.2
  Bottom Layer w1.27: M1.6 113.28,7.37 115.7,9.78 115.7,31.37 P1.2
MOTOR_FL_A: length 81.3
  Top Layer w0.254: LQ_KV58P144-SYSVG1.82 52.78,28.32 65.28,15.82 65.28,9.27 67.31,7.24 114.05,7.24 M1.4
MOTOR_FL_B: length 86.1
  Top Layer w0.254: LQ_KV58P144-SYSVG1.81 48.98,28.32 50.13,29.46 52.35,29.46 65.79,16.03 65.79,16 67.94,13.84 67.94,9.4 69.6,7.75 116.08,7.75 M1.3
MOTOR_FR_+: length 80.7
  Bottom Layer w1.27: M3.6 47.64,2.79 47.64,3.58 49.4,5.33 59.82,5.33 62.36,7.87 87,7.87 91.06,11.94 99.19,11.94 102.11,14.86 102.11,19.69 112.65,30.23 P1.3
MOTOR_FR_-: length 65.9
  Bottom Layer w1.27: P1.4 112.39,26.42 103.63,17.65 103.63,12.95 100.97,10.29 91.57,10.29 87.63,6.35 63.25,6.35 M3.1
MOTOR_FR_A: length 8
  Top Layer w0.254: LQ_KV58P144-SYSVG1.96 51.44,10.33 52.07,9.7 M3.4
MOTOR_FR_B: length 11.6
  Top Layer w0.254: M3.3 52.83,4.57 52.83,11.68 LQ_KV58P144-SYSVG1.95
MOTOR_FTM_BL: length 69.4
  Top Layer w0.254: J3.3 123.19,48.77 116.16,48.77 114.17,50.76 114.17,56.47 111.84,58.8 66.67,58.8 LQ_KV58P144-SYSVG1.50
MOTOR_FTM_BR: length 68.5
  Top Layer w0.254: J3.4 121.16,48.26 115.95,48.26 113.66,50.55 113.66,56.26 111.63,58.29 67.02,58.29 65.54,56.82 65.54,55.22 64.13,53.81 LQ_KV58P144-SYSVG1.49
MOTOR_FTM_FL: length 34.8
  Top Layer w0.254: J2.3 109.98,48.77 105.66,48.77 104.14,50.29 104.14,55.58 101.94,57.78 85.98,57.78 LQ_KV58P144-SYSVG1.34
MOTOR_FTM_FR: length 35.4
  Top Layer w0.254: J2.4 107.95,48.26 105.45,48.26 103.63,50.08 103.63,55.37 101.73,57.28 89.99,57.28 87.76,55.04 83.24,55.04 LQ_KV58P144-SYSVG1.35
NETBZ1_2: length 5.5
  Bottom Layer w0.254: BZ1.2 93.66,53.45 D6.1 94.66,53.4 Q3.3
NETC41_1: length 8.7
  Top Layer w0.254: C41.1 29.71,59.35 U16.4
NETC46_1: length 3.7
  Top Layer w0.254: C46.1 28.83,29.34 29.49,29.99 U17.1
NETLED1_1: length 8.9
  Bottom Layer w0.254: 100.08,41.15 97.03,41.15 95.5,42.67 R31.1
NETLED2_1: length 2.7
  Bottom Layer w0.254: R32.1 92.2,41.28 LED2.1
NETQ3_1: length 9.8
  Bottom Layer w0.254: R23.2 R22.2 97.72,49.78 98.1,50.17 Q3.1
NETR15_1: length 10.5
  Top Layer w0.254: U16.2 38.42,55.96 R15.1 R16.2
NETR17_1: length 5.8
  Top Layer w0.254: R18.2 R17.1 36.77,31.18 35.58,29.99 U17.4
NETR33_1: length 4.6
  Top Layer w0.254: v2(99.95,18.8) 100.98,19.83 S9.1
  Bottom Layer w0.254: R33.1 99.19,18.03 v2(99.95,18.8)
NETR34_1: length 5.3
  Top Layer w0.254: S3.1 100.98,14.47 v2(99.82,15.62)
  Bottom Layer w0.254: R34.1 99.19,16.26 v2(99.82,15.62)
PB0: length 68.1
  Top Layer w0.254: LQ_KV58P144-SYSVG1.70 50.16,44.83 48.34,44.83 47.12,46.06 47.12,56.64 48.81,58.33 62.06,58.33 62.65,58.93 62.68,58.93 64.71,60.96 69.72,60.96 74.29,65.53 93.52,65.53 UART0.3
PB1: length 80.8
  Top Layer w0.254: UART0.2 94.03,62.48 98.68,62.48 99.31,63.12 99.31,65.02 98.3,66.04 74.08,66.04 69.51,61.47 64.5,61.47 62.47,59.44 62.44,59.44 61.85,58.84 48.6,58.84 46.61,56.85 46.61,45.85 LQ_KV58P144-SYSVG1.69
PC3: length 111.7
  Top Layer w0.254: UART1.3 108.22,65.79 99.27,65.79 98.51,66.55 73.87,66.55 69.3,61.98 64.26,61.98 61.64,59.35 48.05,59.35 45.97,57.28 45.97,28.28 46.99,27.26 46.99,17.53 LQ_KV58P144-SYSVG1.91
PC4: length 130.9
  Top Layer w0.254: LQ_KV58P144-SYSVG1.94 47.62,11.81 47.62,16 46.48,17.14 46.48,27.05 45.47,28.07 45.47,57.49 47.84,59.86 61.43,59.86 64.05,62.48 69.09,62.48 73.66,67.06 102.36,67.06 103.12,66.29 112.52,66.29 113.92,64.9 113.92,63.25 113.03,62.36 109.1,62.36 UART1.2
PC14: length 61.1
  Bottom Layer w0.254: LQ_KV58P144-SYSVG1.104 61.84,10.54 62.31,11 62.31,11 62.86,11.56 62.86,29.84 53.21,39.5 53.21,51.05 55.25,53.09 55.25,57.15 50.16,62.23 UART4.3
PC15: length 57.4
  Bottom Layer w0.254: UART4.2 52.7,58.98 52.7,39.29 62.31,29.68 62.31,13.84 61.59,13.12 LQ_KV58P144-SYSVG1.103
PD2: length 80.3
  Top Layer w0.254: UART2.3 75.56,59.56 65.02,59.56 62.73,57.26 62.73,55.66 62.11,55.04 61.01,55.04 60.46,54.5 60.46,53.44 59.52,52.5 58.34,52.5 56.26,50.42 56.26,27.13 67.39,16 70.74,16 73.03,13.72 73.03,11.81 LQ_KV58P144-SYSVG1.112
PD3: length 75.4
  Top Layer w0.254: LQ_KV58P144-SYSVG1.111 69.85,14.99 67.69,14.99 55.75,26.92 55.75,50.63 57.92,52.8 57.92,54.28 58.59,54.94 59.64,54.94 60.32,55.63 60.32,56.77 61.21,57.66 62.36,57.66 64.77,60.07 75.35,60.07 77.52,62.23 UART2.2
PD8: length 64.3
  Bottom Layer w0.254: UART5.3 65.11,64.01 60.46,59.36 60.46,33.9 80.64,13.72 80.64,11.81 LQ_KV58P144-SYSVG1.118
PD9: length 61.8
  Bottom Layer w0.254: UART5.2 62.57,62.19 57.92,57.54 57.92,53.86 57.91,53.85 57.91,52.84 59.82,50.94 59.82,33.83 79.32,14.32 79.32,13.14 LQ_KV58P144-SYSVG1.117
PE1: length 21.5
  Top Layer w0.254: S2.4 91.44,27.81 90.55,26.92 90.55,19.56 87.88,16.89 85.72,16.89 LQ_KV58P144-SYSVG1.2
  Bottom Layer w0.254: S2.4 95,27.81 95.12,27.94 R103.2
PE2: length 19.6
  Top Layer w0.254: LQ_KV58P144-SYSVG1.3 87.42,18.16 90.04,20.78 90.04,29.34 91.06,30.35 S2.3
  Bottom Layer w0.254: S2.3 R102.2
PE3: length 24.3
  Top Layer w0.254: LQ_KV58P144-SYSVG1.4 85.72,19.43 87.63,19.43 89.53,21.34 89.53,31.75 90.68,32.89 S2.2
  Bottom Layer w0.254: S2.2 95,32.89 95.13,32.77 R101.2
PE4: length 22.6
  Top Layer w0.254: LQ_KV58P144-SYSVG1.5 87.42,20.7 87.76,21.04 87.84,21.04 89.03,22.23 89.03,33.91 90.55,35.43 S2.1
  Bottom Layer w0.254: R100.2 95.38,35.18 95.12,35.43 S2.1
PE5: length 150.4
  Top Layer w0.254: v3(57.77,26.54) 72.14,26.54 77.98,20.7 LQ_KV58P144-SYSVG1.6
  Bottom Layer w0.254: v3(57.77,26.54) 57.28,26.54 55.5,24.77 55.5,17.91 51.94,14.35 45.85,14.35 43.69,16.51 43.69,58.17 38.35,63.5 14.55,63.5 13.97,62.92 13.97,45.47 9.78,41.28
PE6: length 135.8
  Top Layer w0.254: v3(57.77,29) 75.14,29 82.17,21.97 85.3,21.97 86.57,23.24 LQ_KV58P144-SYSVG1.7
  Bottom Layer w0.254: SERVO2.3 12.45,52.96 12.45,63.55 13.92,65.02 38.99,65.02 45.21,58.8 45.21,24 47.24,21.97 51.85,21.97 52.65,22.77 52.65,22.81 53.85,24 53.85,26.67 56.13,28.95 57.72,28.95 v3(57.77,29)
PE7: length 118.1
  Top Layer w0.254: LQ_KV58P144-SYSVG1.8 81.91,23.24 80.26,24.89 80.26,27.43 76.24,31.45 v3(57.77,31.45)
  Bottom Layer w0.254: v3(57.77,31.45) 54.95,31.45 53.09,29.59 47.88,29.59 46.74,30.73 46.74,59.43 39.62,66.55 13.29,66.55 10.92,64.18 10.92,60.2 SERVO3.3
PE8: length 146.3
  Top Layer w0.254: LQ_KV58P144-SYSVG1.9 85.6,24.38 82.17,24.38 v3(81.66,24.89) ; v3(57.77,27.36) 72.97,27.36 74.93,25.4 v3(77.09,25.4)
  Bottom Layer w0.254: v3(57.77,27.36) 57.08,27.36 54.99,25.27 54.99,20.03 51.98,17.02 46.1,17.02 44.2,18.92 44.2,58.38 38.56,64.01 14.34,64.01 13.46,63.13 13.46,47.88 SERVO4.3 ; v3(81.66,24.89) 81.15,25.4 v3(77.09,25.4)
PE9: length 126
  Top Layer w0.254: v3(78.87,27.36) 76.41,29.82 v3(57.77,29.82) ; v3(81.28,27.69) 82.55,27.69 LQ_KV58P144-SYSVG1.10
  Bottom Layer w0.254: v3(78.87,27.36) 79.19,27.69 v3(81.28,27.69) ; SERVO5.3 11.94,55.37 11.94,63.76 13.71,65.53 39.2,65.53 45.72,59.01 45.72,26.03 47.12,24.64 51.98,24.64 53.21,25.87 53.21,27.18 55.85,29.82 v3(57.77,29.82)
PE10: length 112.1
  Top Layer w0.254: v3(57.77,32.27) 78.35,32.27 81.03,29.59 85.72,29.59 LQ_KV58P144-SYSVG1.11
  Bottom Layer w0.254: SERVO6.3 9.65,61.97 10.41,62.73 10.41,64.39 13.08,67.06 39.83,67.06 47.24,59.64 47.24,33.15 48.01,32.39 48.11,32.39 48.22,32.27 v3(57.77,32.27)
PE11: length 137.7
  Top Layer w0.254: v3(75.31,26.67) 73.8,28.18 v3(57.77,28.18) ; v3(80.52,28.83) 83.59,28.83 84.08,28.34 LQ_KV58P144-SYSVG1.12
  Bottom Layer w0.254: v3(75.31,26.67) 77.47,28.83 v3(80.52,28.83) ; SERVO7.3 12.95,50.42 12.95,63.34 14.13,64.52 38.77,64.52 44.7,58.59 44.7,21.59 46.99,19.3 51.73,19.3 54.48,22.06 54.48,26.03 56.63,28.18 v3(57.77,28.18)
PE12: length 121.9
  Top Layer w0.254: LQ_KV58P144-SYSVG1.13 85.72,32.13 81.45,32.13 v3(80.77,31.45) ; 57.7,30.63 v3(57.77,30.63) 57.8,30.61 v3(75.56,30.61)
  Bottom Layer w0.254: v3(75.56,30.61) 79.93,30.61 v3(80.77,31.45) ; SERVO8.3 11.43,57.78 11.43,63.97 13.5,66.04 39.41,66.04 46.23,59.22 46.23,28.45 47.5,27.18 51.98,27.18 55.44,30.63 v3(57.77,30.63)
SERVO_POWER: length 58.6
  Top Layer w0.254: R15.2 C43.1 40.04,49.77 C42.1
  Bottom Layer w1.778: 7.11,61.98 SERVO6.2 SERVO3.2 SERVO8.2 SERVO5.2 SERVO2.2 SERVO7.2 SERVO4.2 SERVO1.2 7.11,40.39 8.51,38.99 25.53,38.99 33.27,46.74 33.27,47.22
  vias: v1(33.02,49.53) v1(33.02,47.88) v1(33.02,46.23) v1(34.67,49.53) v1(34.67,47.88) v1(34.67,46.23) v1(36.32,49.53) v1(36.32,47.88) v1(36.32,46.23)

## Copper pours and planes (outline as drawn; the poured copper is in the pictures)
3V3 on Top Layer: 70.61,49.28 72.39,49.28 72.39,45.72 70.61,45.72
3V3 on Top Layer: 67.06,49.4 72.39,49.4 72.39,47.37 67.06,47.37
3V3_OTH on Top Layer: 34.16,13.59 38.83,13.59 38.83,9.78 34.16,9.78
5V on Top Layer: 26.29,12.45 30.73,12.45 30.73,9.78 26.29,9.78
5V on Top Layer: 31.11,27.56 36.96,27.56 36.96,20.13 31.11,20.13
5V on Top Layer: 75.95,49.53 81.53,49.53 81.53,46.99 75.95,46.99
5V on Top Layer: 34.33,27.56 41.66,27.56 41.66,23.5 34.33,23.5
GND on Top Layer: -3.43,70.36 -3.43,-1.78 133.1,-1.78 133.1,71.25
GND on Bottom Layer: -1.78,70.23 -1.78,-1.27 133.6,-1.27 133.6,70.61
VCC on Top Layer: 2.29,19.94 7.62,19.94 7.62,5.46 2.29,5.46
VCC on Top Layer: 11.81,9.27 14.48,9.27 14.48,1.78 11.81,1.78
VCC on Top Layer: 5.08,9.27 12.19,9.27 12.19,5.46 5.08,5.46
VCC on Top Layer: 12.95,4.95 20.07,4.95 20.07,1.78 12.95,1.78
VCC on Top Layer: 2.29,19.94 11.81,19.94 11.81,15.37 2.29,15.37
VIN on Top Layer: 12.32,27.56 16.89,27.56 16.89,19.18 12.32,19.18
VIN on Top Layer: 6.48,28.58 18.8,28.58 18.8,21.21 6.48,21.21
VIN on Top Layer: 6.48,28.58 12.57,28.58 12.57,20.45 6.48,20.45
VIN on Top Layer: 12.32,20.07 16.89,20.07 16.89,9.78 12.32,9.78
VIN on Top Layer: 14.86,9.27 20.07,9.27 20.07,5.33 14.86,5.33
VIN on Top Layer: 14.86,15.24 20.32,15.24 20.32,5.33 14.86,5.33
VIN on Top Layer: 27.81,65.79 38.99,65.79 38.99,60.33 27.81,60.33
VIN on Bottom Layer: 31.24,63.12 37.46,63.12 37.46,59.64 31.24,59.64
NETC46_2 on Top Layer: 21.97,37.59 31.11,37.59 31.11,20.07 21.97,20.07
NETD4_2 on Top Layer: 24,61.59 31.5,61.59 31.5,53.72 24,53.72
NETD4_2 on Top Layer: 11.18,63.12 27.05,63.12 27.05,40 11.18,40
NETP5_2 on Top Layer: 11.68,33.78 18.8,33.78 18.8,29.27 11.68,29.27
NETP5_2 on Top Layer: 10.79,37.59 18.8,37.59 18.8,29.27 10.79,29.27
NETP5_2 on Top Layer: 7.37,37.59 11.94,37.59 11.94,34.35 7.37,34.35
SERVO_POWER on Top Layer: 31.88,50.67 41.27,50.67 41.27,41.4 31.88,41.4
SERVO_POWER on Bottom Layer: 31.88,50.67 37.21,50.67 37.21,45.47 31.88,45.47

## Text on the board
Top Silkscreen Layer: FR0 | FR2 | FR1 | G | V | FL0 | FL1 | FL2 | BR0 | BR2 | BR1 | BL0 | BL1 | BL2 | T | R | LED1 | LED2 | BUT2 | BUT1 | + V A B G - | FL+ | FL- | FR+ | FR- | BL+ | BL- | BR- | BR+
